# EAGLE design 6550 (EAGLE 6.6.0)
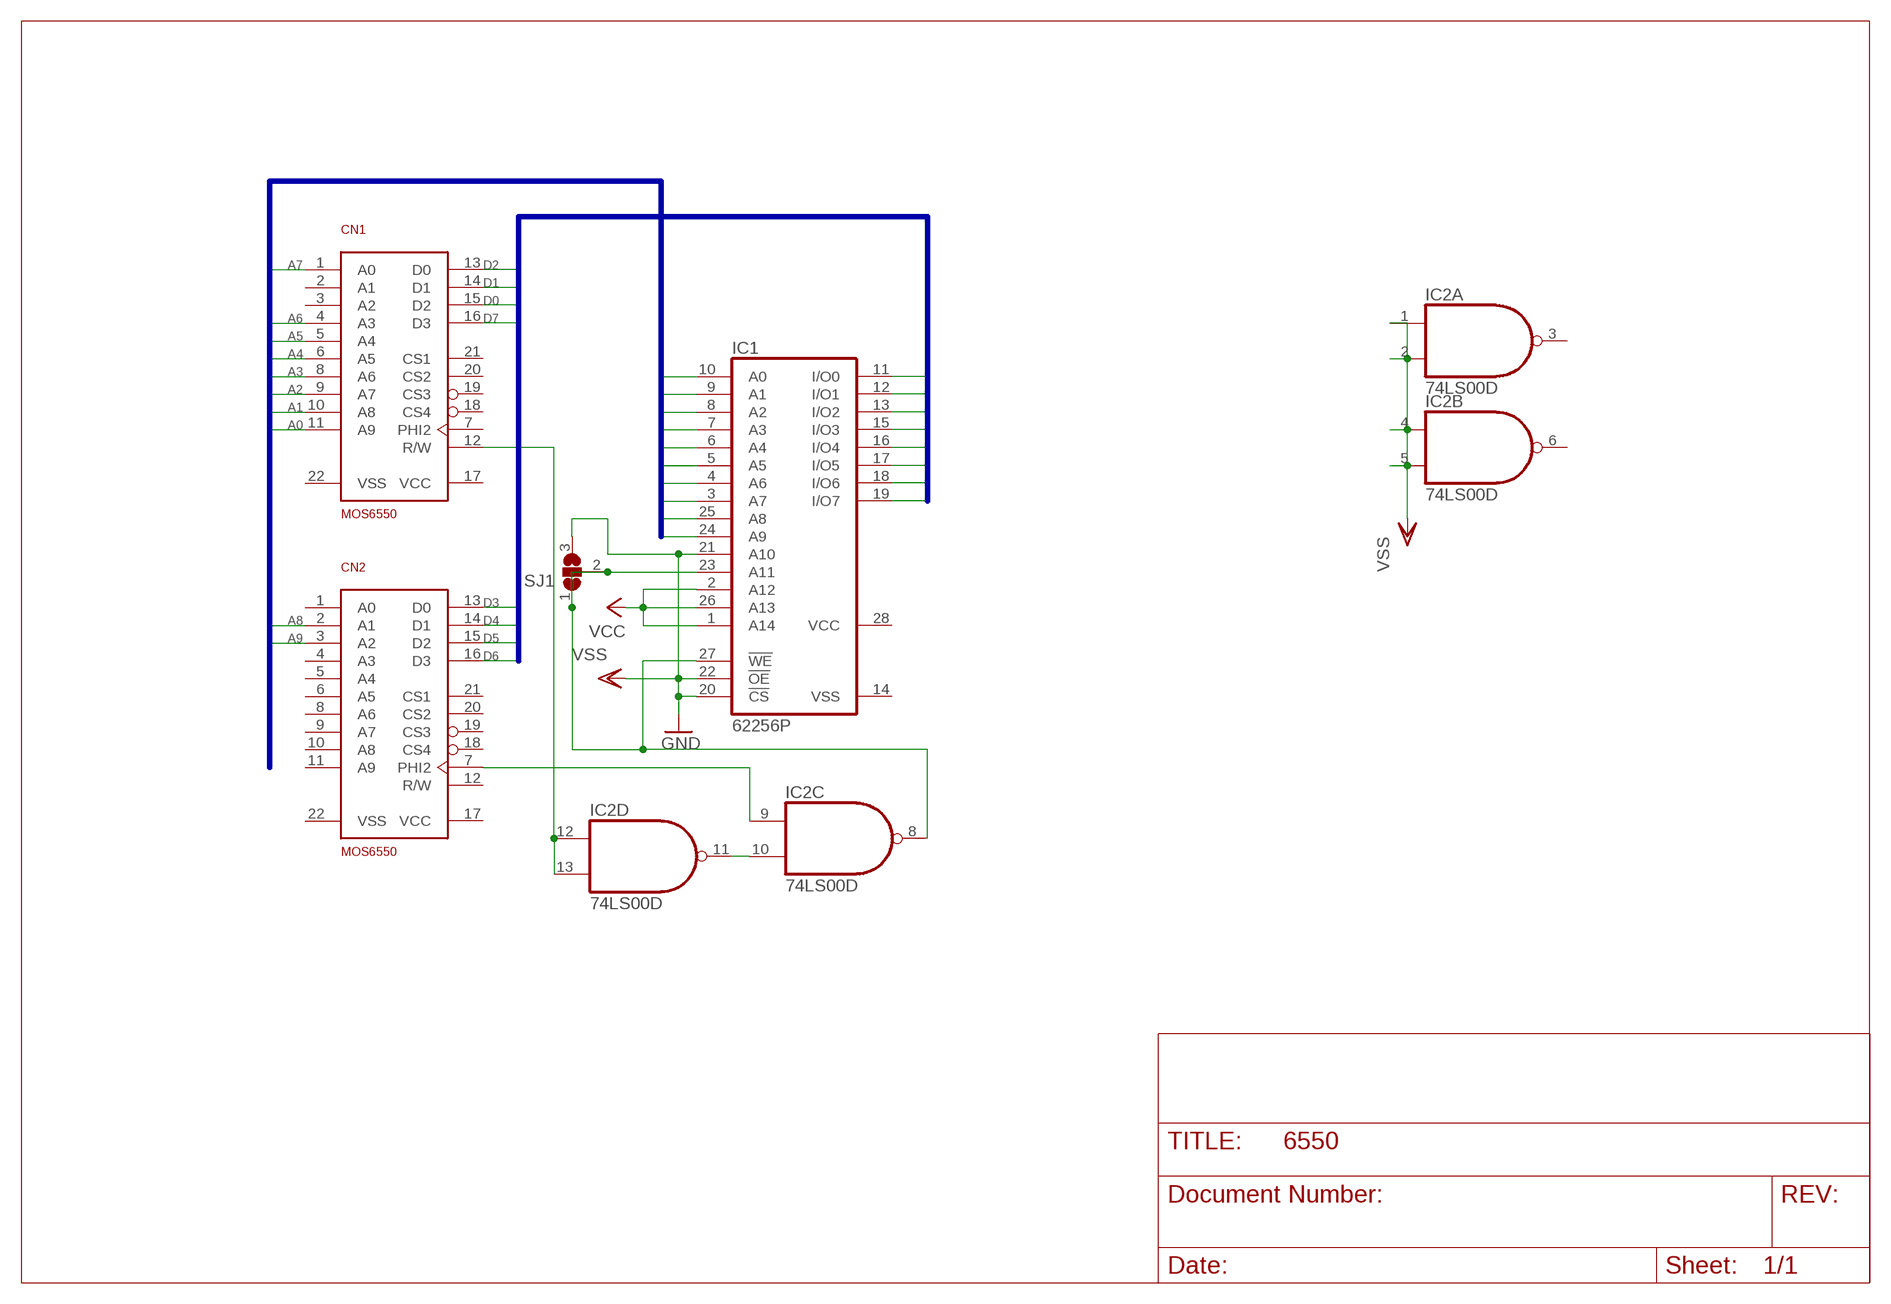
[diagram p0: schematic, sheet 1]

## Parts
CN1  MOS6550  [DIP-22]
CN2  MOS6550  [DIP-22]
IC1  62256P  [DIL28-6]
IC2  74LS00D  [SO14]
SJ1  SJ2W  [SJ_2]

## Nets
A0: CN1.11(A9) IC1.10(A0)
A1: CN1.10(A8) IC1.9(A1)
A2: CN1.9(A7) IC1.8(A2)
A3: CN1.8(A6) IC1.7(A3)
A4: CN1.6(A5) IC1.6(A4)
A5: CN1.5(A4) IC1.5(A5)
A6: CN1.4(A3) IC1.4(A6)
A7: CN1.1(A0) IC1.3(A7)
A8: CN2.2(A1) IC1.25(A8)
A9: CN2.3(A2) IC1.24(A9)
D0: CN1.15(D2) IC1.11(I/O0)
D1: CN1.14(D1) IC1.12(I/O1)
D2: CN1.13(D0) IC1.13(I/O2)
D3: CN2.13(D0) IC1.15(I/O3)
D4: CN2.14(D1) IC1.16(I/O4)
D5: CN2.15(D2) IC1.17(I/O5)
D6: CN2.16(D3) IC1.18(I/O6)
D7: CN1.16(D3) IC1.19(I/O7)
N$1: CN1.12(R/W) IC2.12(D:I0) IC2.13(D:I1)
N$2: IC2.10(C:I1) IC2.11(D:O)
N$3: CN2.7(PHI2) IC2.9(C:I0)
N$4: IC1.23(A11) IC1.27(!WE) IC2.8(C:O) SJ1.1 SJ1.2
VCC: IC1.1(A14) IC1.2(A12) IC1.26(A13)
VSS: IC1.20(!CS) IC1.21(A10) IC1.22(!OE) IC2.1(A:I0) IC2.2(A:I1) IC2.4(B:I0) IC2.5(B:I1) SJ1.3 ; supply symbol labelled GND
Unconnected: CN1.2(A1) CN1.3(A2) CN1.7(PHI2) CN1.18(CS4) CN1.19(CS3) CN1.20(CS2) CN1.21(CS1) CN2.1(A0) CN2.4(A3) CN2.5(A4) CN2.6(A5) CN2.8(A6) CN2.9(A7) CN2.10(A8) CN2.11(A9) CN2.12(R/W) CN2.18(CS4) CN2.19(CS3) CN2.20(CS2) CN2.21(CS1) IC2.3(A:O) IC2.6(B:O)

## Buses
A[0..9]
D[0..7]

## Power pins joined to a net without a drawn wire
VCC: CN1.17(VCC) CN2.17(VCC) IC1.28(VCC) IC2.14(P:VCC)
VSS: CN1.22(VSS) CN2.22(VSS) IC1.14(VSS) IC2.7(P:GND)

## Library data of the parts
CN1 CN2 = 65XXX:MOS6550
IC1 = memory-hitachi:62256P: MEMORY; OC_FARNELL: unknown; OC_NEWARK: unknown
IC2 = 74xx-us:74*00: Quad 2-input NAND gate
SJ1 = jumper:SJ2W: SMD solder JUMPER

## Board
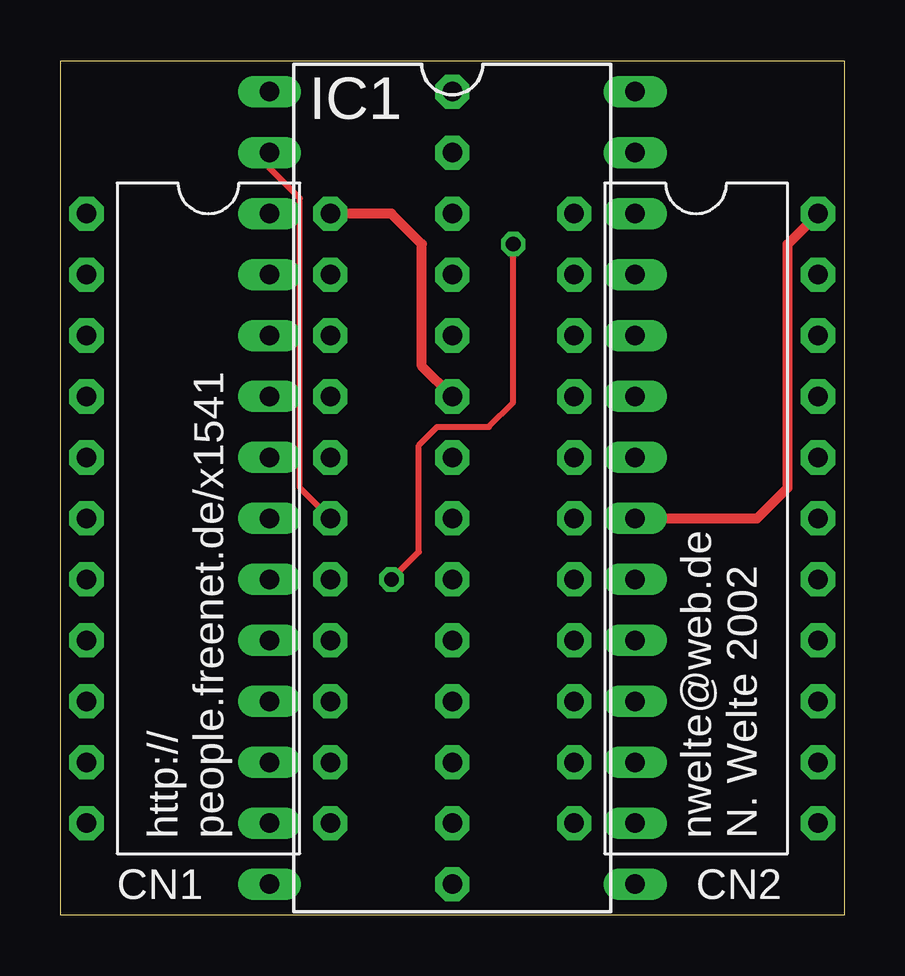
[diagram p1: board, top side]
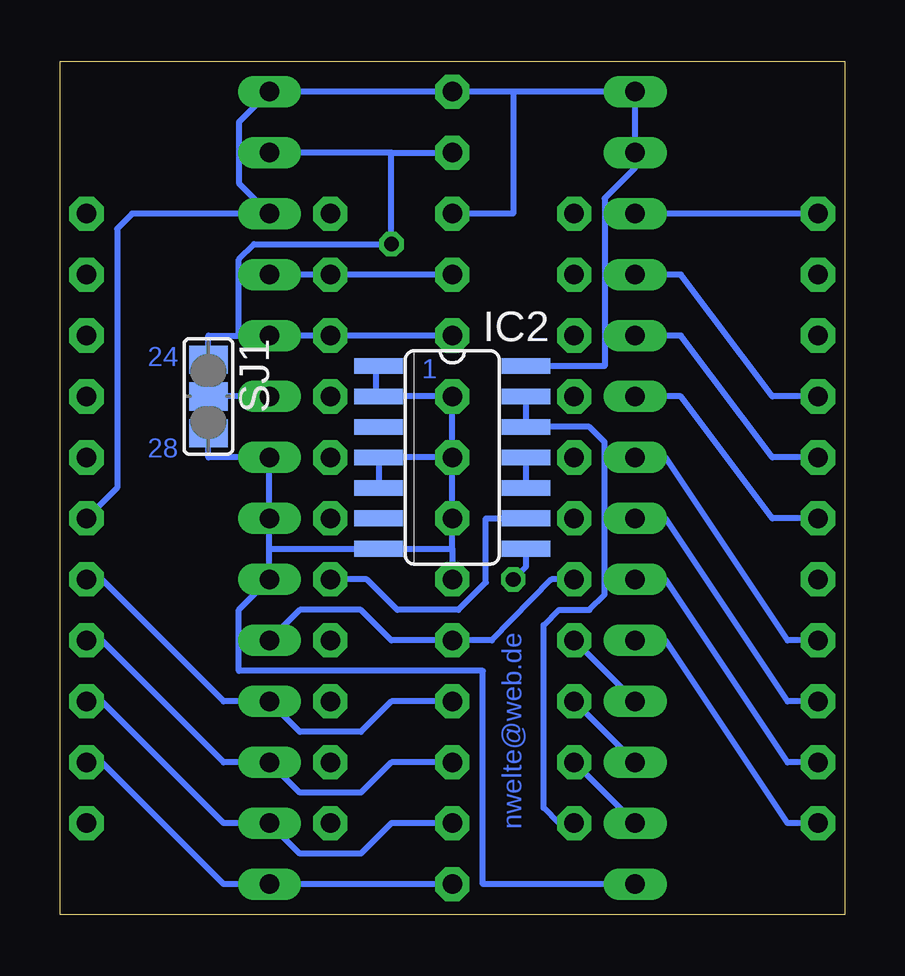
[diagram p2: board, bottom side, seen from below]

Size 32.69 x 35.55 mm. Coordinates in mm from the lower left corner, seen from the top.
Outline: 0,0 32.69,0 32.69,35.55 0,35.55 0,0
Copper layers (1*16): Top 0.035mm / dielectric 1.5mm / Bottom 0.035mm
Design rules "default *": minimum track width 10mil, minimum drill 24mil, track to track 8mil, track to pad 8mil, pad to pad 8mil, via to via 8mil, smd to smd 8mil, copper to edge 15mil, drill to drill 8mil, minimum pad ring 10mil, minimum via ring 8mil, stop-mask expansion 4mil, vias tented up to drill 0mil, thermal gap 10mil

### Footprints (pad centres in the part's own frame; a part is rotated, then mirrored left to right if it is on the bottom)
DIP-22 = drill 0.813 pad 1.422 octagon: 1 -5.08,12.7; 2 -5.08,10.16; 3 -5.08,7.62; 4 -5.08,5.08; 5 -5.08,2.54; 6 -5.08,0; 7 -5.08,-2.54; 8 -5.08,-5.08; 9 -5.08,-7.62; 10 -5.08,-10.16; 11 -5.08,-12.7; 12 5.08,-12.7; 13 5.08,-10.16; 14 5.08,-7.62; 15 5.08,-5.08; 16 5.08,-2.54; 17 5.08,0; 18 5.08,2.54; 19 5.08,5.08; 20 5.08,7.62; 21 5.08,10.16; 22 5.08,12.7
DIL28-6 = drill 0.813 long: 1 -16.51,-7.62; 2 -13.97,-7.62; 3 -11.43,-7.62; 4 -8.89,-7.62; 5 -6.35,-7.62; 6 -3.81,-7.62; 7 -1.27,-7.62; 8 1.27,-7.62; 9 3.81,-7.62; 10 6.35,-7.62; 11 8.89,-7.62; 12 11.43,-7.62; 13 13.97,-7.62; 14 16.51,-7.62; 15 16.51,7.62; 16 13.97,7.62; 17 11.43,7.62; 18 8.89,7.62; 19 6.35,7.62; 20 3.81,7.62; 21 1.27,7.62; 22 -1.27,7.62; 23 -3.81,7.62; 24 -6.35,7.62; 25 -8.89,7.62; 26 -11.43,7.62; 27 -13.97,7.62; 28 -16.51,7.62
SO14 = smd 0.66 x 2.032: 1 -3.81,-3.073; 2 -2.54,-3.073; 3 -1.27,-3.073; 4 0,-3.073; 5 1.27,-3.073; 6 2.54,-3.073; 7 3.81,-3.073; 8 3.81,3.073; 9 2.54,3.073; 10 1.27,3.073; 11 0,3.073; 12 -1.27,3.073; 13 -2.54,3.073; 14 -3.81,3.073
SJ_2 = smd 1.168 x 1.6: 1 -1.524,0; 2 0,0; 3 1.524,0

### Placement (x,y rotation side)
CN1  6.18,16.51 0 top
CN2  26.5,16.51 0 top
IC1  16.34,17.78 270 top
IC2  16.34,19.05 270 bottom
SJ1  26.5,21.59 270 bottom

### Tracks (layer width: path | path; a pad name or v marks a point on that pad's centre or on a via)
A0
  Bottom 0.254: CN1.11 2.38,3.81 7.46,11.42 IC1.10
A1
  Bottom 0.254: CN1.10 2.38,6.34 7.46,13.96 IC1.9
A2
  Bottom 0.254: CN1.9 2.38,8.88 7.46,16.51 IC1.8
A3
  Bottom 0.254: CN1.8 2.38,11.42 7.46,19.05 IC1.7
A4
  Bottom 0.254: CN1.6 3.01,16.51 6.82,21.59 IC1.6
A5
  Bottom 0.254: CN1.5 3.01,19.05 6.82,24.12 IC1.5
A6
  Bottom 0.254: CN1.4 3.01,21.59 6.82,26.67 IC1.4
A7
  Bottom 0.254: CN1.1 IC1.3
A8  (via drill 0.81 pad 1.42)
  Bottom 0.254: v16.34,26.67 CN2.2 | CN2.2 IC1.25 CN2.2
A9  (via drill 0.81 pad 1.42)
  Bottom 0.254: v16.34,24.12 CN2.3 | CN2.3 IC1.24 CN2.3
D0
  Bottom 0.254: IC1.11 CN1.15
D1
  Bottom 0.254: IC1.12 CN1.14
D2
  Bottom 0.254: IC1.13 CN1.13
D3  (via drill 0.81 pad 1.42)
  Bottom 0.254: CN2.13 30.95,6.34 25.87,1.27 IC1.15 v16.34,1.27
D4  (via drill 0.81 pad 1.42)
  Bottom 0.254: CN2.14 30.95,8.88 25.87,3.81 IC1.16 22.7,2.54 20.16,2.54 18.88,3.81 v16.34,3.81
D5  (via drill 0.81 pad 1.42)
  Bottom 0.254: CN2.15 30.95,11.42 25.87,6.34 IC1.17 22.7,5.08 20.16,5.08 18.88,6.34 v16.34,6.34
D6  (via drill 0.81 pad 1.42)
  Bottom 0.254: CN2.16 30.95,13.96 25.87,8.88 IC1.18 22.7,7.62 20.16,7.62 18.88,8.88 v16.34,8.88
D7  (via drill 0.81 pad 1.42)
  Bottom 0.254: IC1.19 22.7,12.69 20.16,12.69 18.88,11.42 v16.34,11.42 14.69,11.42 12.22,13.96 CN1.16
N$1
  Bottom 0.254: CN1.12 11.9,3.81 12.54,4.44 12.54,12.06 11.9,12.69 10.63,12.69 9.99,13.33 9.99,19.68 10.63,20.32 IC2.12 13.27,21.48 13.17,21.59 IC2.13
N$2
  Bottom 0.254: IC2.10 13.17,17.78 13.27,17.88 IC2.11
N$3
  Bottom 0.254: IC2.9 14.95,16.51 14.95,13.84 16.09,12.69 18.63,12.69 19.9,13.96 CN2.7
N$4  (via drill 0.61, 0.81 pad 1.42)
  Top 0.254: v13.8,13.96 14.95,15.11 14.95,19.55 15.71,20.32 17.87,20.32 18.88,21.33 v18.88,27.94
  Bottom 0.254: 18.88,31.75 v18.88,27.94 24.6,27.94 25.23,27.3 25.23,24.12 26.5,24.12 SJ1.1 SJ1.2 IC1.23 | 18.88,31.75 v16.34,31.75 | 18.88,31.75 IC1.27 | 13.17,15.23 IC2.8 13.27,14.5 v13.8,13.96
VCC  (via drill 0.81 pad 1.42)
  Top 0.254: CN1.17 9.99,17.78 9.99,29.84 8.72,31.11 IC1.2
  Bottom 0.254: 13.8,34.28 IC1.1 IC1.2 8.72,31.11 9.99,29.84 9.99,22.86 IC2.14 | 13.8,34.28 13.8,29.21 v16.34,29.21 | 13.8,34.28 v16.34,34.28 IC1.28 25.23,33.02 25.23,30.48 IC1.26 29.68,29.21 30.32,28.57 30.32,17.78 CN2.17
VSS  (via drill 0.81 pad 1.42)
  Top 0.406: v16.34,21.59 15.07,22.86 15.07,27.94 13.8,29.21 CN1.22 | CN2.22 30.32,27.94 30.32,17.78 29.04,16.51 IC1.21
  Bottom 0.254: IC1.14 15.07,1.27 15.07,10.15 25.23,10.15 25.23,12.69 IC1.20 23.96,15.23 | v16.34,19.05 v16.34,21.59 19.52,21.59 | v16.34,19.05 v16.34,16.51 16.34,15.23 | 23.96,15.23 IC1.21 IC1.22 26.5,19.05 SJ1.3 26.5,20.32 | 16.34,15.23 v16.34,13.96 | IC2.7 19.52,15.23 | IC2.7 16.34,15.23 | 23.96,15.23 IC2.7 | 19.52,21.59 IC2.2 | IC2.1 19.52,22.75 19.52,21.59 | IC2.4 19.52,19.05 | IC2.5 19.52,17.78 19.42,17.88 IC2.4 | v16.34,19.05 IC2.4

### Text on the board
Bottom: 24 | 1 | 28 | nwelte@web.de
tNames: http:// | people.freenet.de/x1541 | nwelte@web.de | N. Welte 2002